# EAGLE design May (EAGLE 9.0.1)
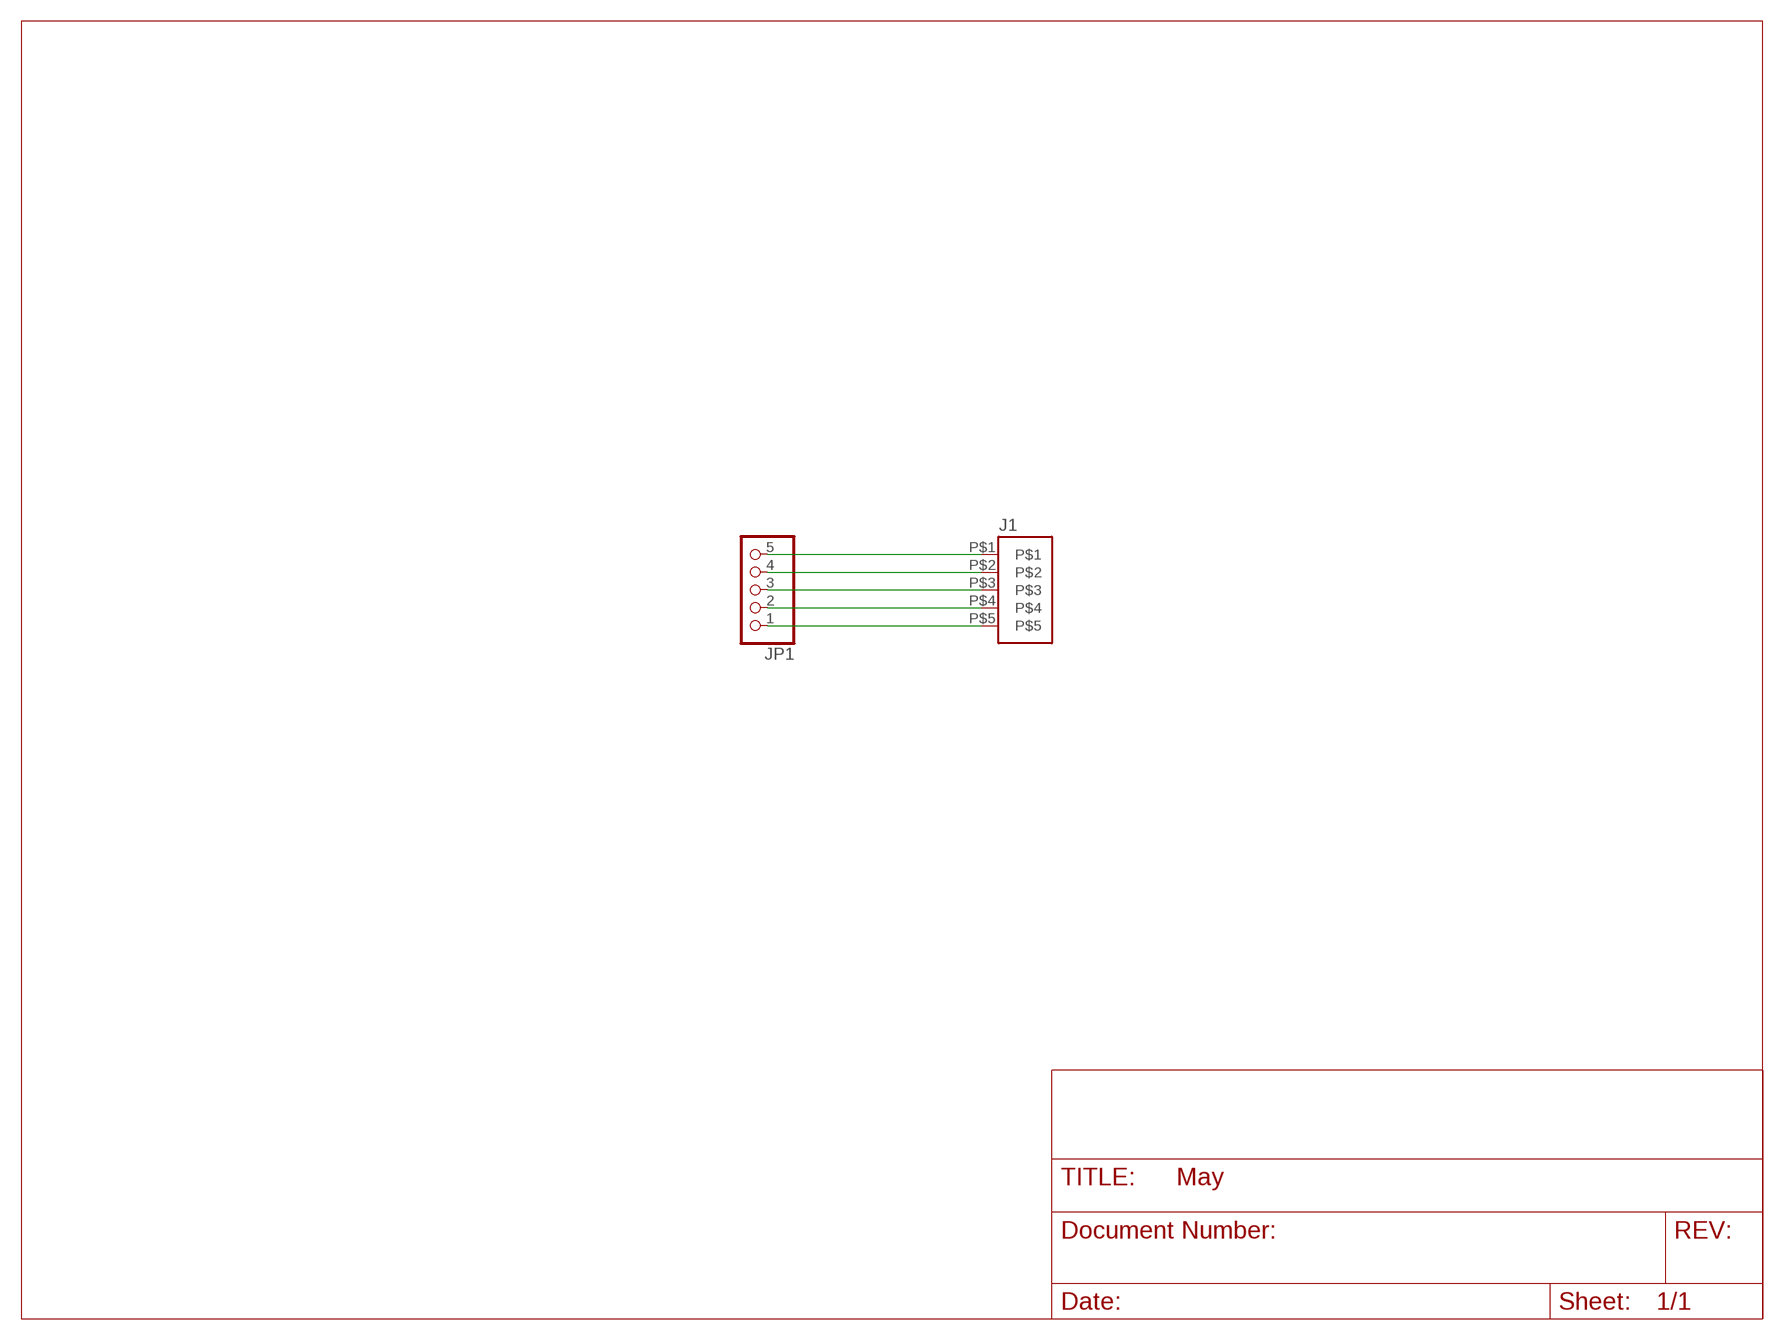
[diagram p0: schematic, sheet 1]

## Parts
J1  AF-PID2139  [TB-01-5]
JP1  PINHD-1X5  [1X05]

## Nets
N$1: J1.P$1 JP1.5
N$2: J1.P$2 JP1.4
N$3: J1.P$3 JP1.3
N$4: J1.P$4 JP1.2
N$5: J1.P$5 JP1.1

## Library data of the parts
J1 = Ooo-Connectors:AF-PID2139
JP1 = pinhead:PINHD-1X5: PIN HEADER

## Board
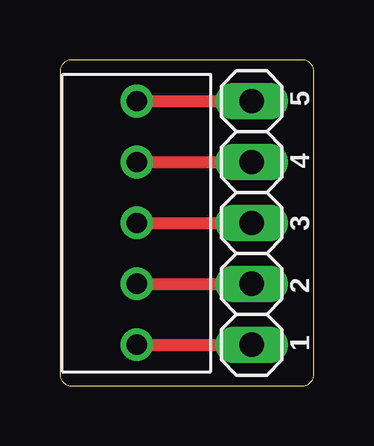
[diagram p1: board, top side]
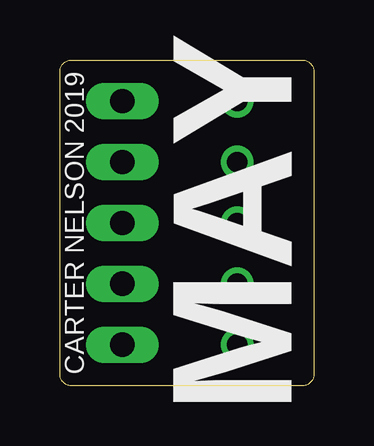
[diagram p2: board, bottom side, seen from below]

Size 10.6 x 13.6 mm. Coordinates in mm from the lower left corner, seen from the top.
Outline: 0,13.1 0,0.5 arc90 0.5,0 10.1,0 arc90 10.6,0.5 10.6,13.1 arc90 10.1,13.6 0.5,13.6 arc90 0,13.1
Copper layers (1*16): Top 0.035mm / dielectric 1.5mm / Bottom 0.035mm
Design rules "default": minimum track width 6mil, minimum drill 0.35mm, track to track 6mil, track to pad 6mil, pad to pad 6mil, via to via 6mil, smd to smd 6mil, copper to edge 40mil, drill to drill 6mil, minimum pad ring 10mil, minimum via ring 8mil, stop-mask expansion 4mil, vias tented up to drill 0mil, thermal gap 10mil

### Footprints (pad centres in the part's own frame; a part is rotated, then mirrored left to right if it is on the bottom)
TB-01-5 = drill 0.85: P$1 0,5.08; P$2 0,2.54; P$3 0,0; P$4 0,-2.54; P$5 0,-5.08
1X05 = drill 1.016 long: 1 -5.08,0; 2 -2.54,0; 3 0,0; 4 2.54,0; 5 5.08,0

### Placement (x,y rotation side)
J1  3.2,6.8 0 top
JP1  8,6.8 90 top

### Tracks (layer width: path | path; a pad name or v marks a point on that pad's centre or on a via)
N$1
  Top 0.508: J1.P$1 JP1.5
N$2
  Top 0.508: J1.P$2 JP1.4
N$3
  Top 0.508: J1.P$3 JP1.3
N$4
  Top 0.508: J1.P$4 JP1.2
N$5
  Top 0.508: J1.P$5 JP1.1

### Text on the board
tPlace: 5 | 4 | 3 | 2 | 1
bPlace: MAY | CARTER NELSON 2019